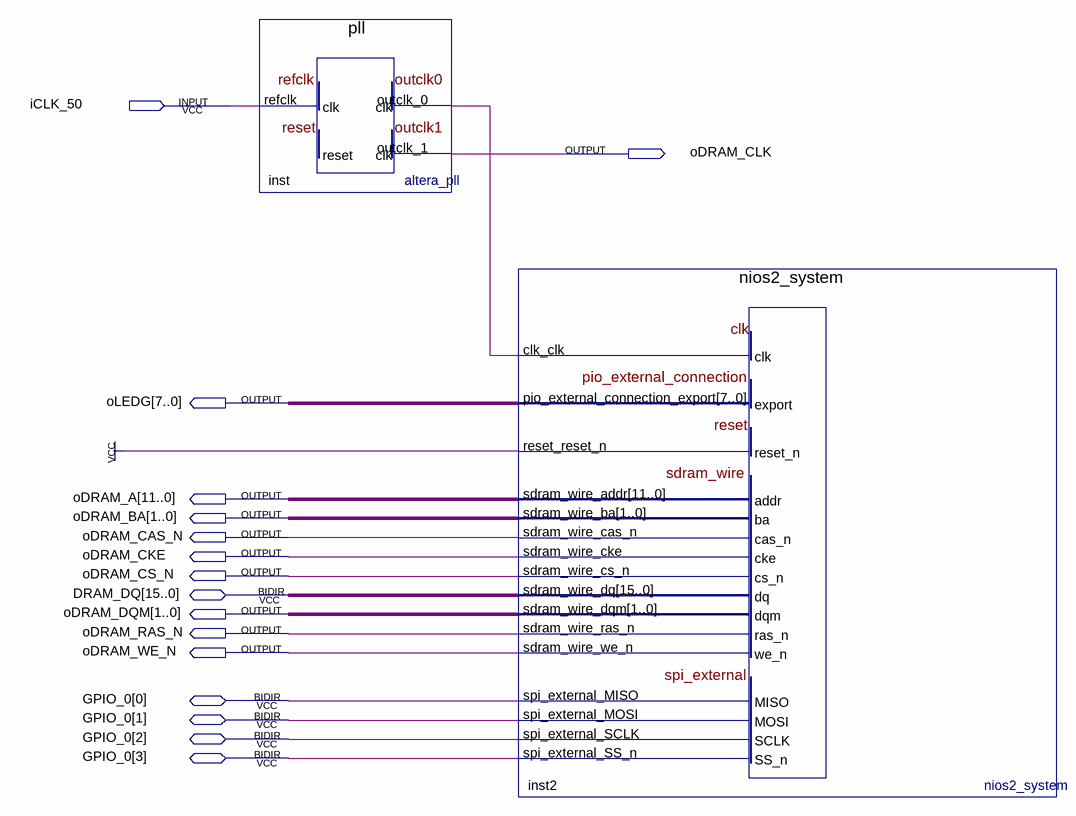
[diagram p0: schematic sheet]
// Quartus schematic pathfinder.bdf as structural Verilog: 2 symbols, 16 pins
module pathfinder (
  input  iCLK_50,
  inout  [15:0] DRAM_DQ,
  inout  [3:0] GPIO_0,
  output oDRAM_CLK,
  output [7:0] oLEDG,
  output [11:0] oDRAM_A,
  output [1:0] oDRAM_BA,
  output oDRAM_CAS_N,
  output oDRAM_CKE,
  output oDRAM_CS_N,
  output [1:0] oDRAM_DQM,
  output oDRAM_RAS_N,
  output oDRAM_WE_N
);

  wire inst_outclk_0;

  pll inst (.refclk(iCLK_50), .outclk_0(inst_outclk_0), .outclk_1(oDRAM_CLK));
  nios2_system inst2 (
    .clk_clk(inst_outclk_0), .reset_reset_n(1'b1), .spi_external_MOSI(GPIO_0[1]),
    .spi_external_SCLK(GPIO_0[2]), .spi_external_SS_n(GPIO_0[3]), .pio_external_connection_export(oLEDG),
    .sdram_wire_addr(oDRAM_A), .sdram_wire_ba(oDRAM_BA), .sdram_wire_cas_n(oDRAM_CAS_N),
    .sdram_wire_cke(oDRAM_CKE), .sdram_wire_cs_n(oDRAM_CS_N), .sdram_wire_dqm(oDRAM_DQM),
    .sdram_wire_ras_n(oDRAM_RAS_N), .sdram_wire_we_n(oDRAM_WE_N), .spi_external_MISO(GPIO_0[0]),
    .sdram_wire_dq(DRAM_DQ));
endmodule
